# EAGLE design ctrl_out (EAGLE 8.5.0)
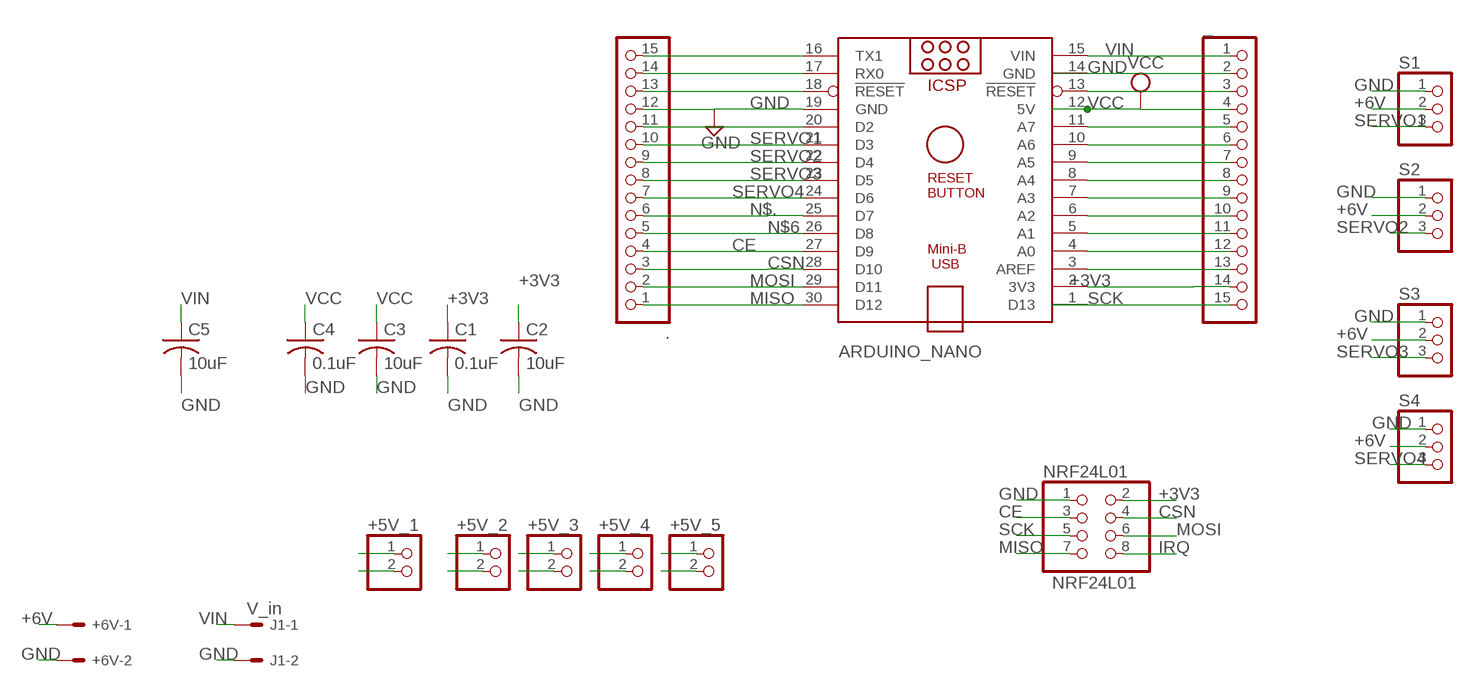
[diagram p0: schematic, sheet 1]

## Parts
+5V_1  PINHD-1X2  [1X02]
+5V_2  PINHD-1X2  [1X02]
+5V_3  PINHD-1X2  [1X02]
+5V_4  PINHD-1X2  [1X02]
+5V_5  PINHD-1X2  [1X02]
+6V  22-27-2021-02  [6410-02]
.  PINHD-1X15  [1X15]
_  PINHD-1X15  [1X15]
ARDUINO_NANO  ARDUINO_NANO  [ARDUINO_NANO]
C1  0.1uF  C-USC1206  [C1206]
C2  10uF  C-USC1206  [C1206]
C3  10uF  C-USC1206  [C1206]
C4  0.1uF  C-USC1206  [C1206]
C5  10uF  C-USC1206  [C1206]
J1  V_in  22-27-2021-02  [6410-02]
NRF24L01  PINHD-2X4  [2X04]
S1  PINHD-1X3  [1X03]
S2  PINHD-1X3  [1X03]
S3  PINHD-1X3  [1X03]
S4  PINHD-1X3  [1X03]

## Nets
+3V3: _.14 ARDUINO_NANO.2(3V3) C1.1 C2.1 NRF24L01.2
+6V: +6V.1 S1.2 S2.2 S3.2 S4.2
CE: ..4 ARDUINO_NANO.27(D9) NRF24L01.3
CSN: ..3 ARDUINO_NANO.28(D10) NRF24L01.4
GND: +5V_1.2 +5V_2.2 +5V_3.2 +5V_4.2 +5V_5.2 +6V.2 ..12 _.2 ARDUINO_NANO.14(GND) ARDUINO_NANO.19(GND) C1.2 C2.2 C3.2 C4.2 C5.2 J1.2 NRF24L01.1 S1.1 S2.1 S3.1 S4.1
IRQ: NRF24L01.8
MISO: ..1 ARDUINO_NANO.30(D12) NRF24L01.7
MOSI: ..2 ARDUINO_NANO.29(D11) NRF24L01.6
N$6: ..5 ARDUINO_NANO.26(D8)
N$12: ..11 ARDUINO_NANO.20(D2)
N$14: ..13 ARDUINO_NANO.18(!RESET)
N$15: ..14 ARDUINO_NANO.17(RX0)
N$16: ..15 ARDUINO_NANO.16(TX1)
N$19: _.3 ARDUINO_NANO.13(!RESET)
N$21: _.5 ARDUINO_NANO.11(A7)
N$22: _.6 ARDUINO_NANO.10(A6)
N$23: _.7 ARDUINO_NANO.9(A5)
N$24: _.8 ARDUINO_NANO.8(A4)
N$25: _.9 ARDUINO_NANO.7(A3)
N$26: _.10 ARDUINO_NANO.6(A2)
N$27: _.11 ARDUINO_NANO.5(A1)
N$28: _.12 ARDUINO_NANO.4(A0)
N$29: _.13 ARDUINO_NANO.3(AREF)
N$.: ..6 ARDUINO_NANO.25(D7)
SCK: _.15 ARDUINO_NANO.1(D13) NRF24L01.5
SERVO1: ..10 ARDUINO_NANO.21(D3) S1.3
SERVO2: ..9 ARDUINO_NANO.22(D4) S2.3
SERVO3: ..8 ARDUINO_NANO.23(D5) S3.3
SERVO4: ..7 ARDUINO_NANO.24(D6) S4.3
VCC: +5V_1.1 +5V_2.1 +5V_3.1 +5V_4.1 +5V_5.1 _.4 ARDUINO_NANO.12(5V) C3.1 C4.1
VIN: _.1 ARDUINO_NANO.15(VIN) C5.1 J1.1

## Library data of the parts
+5V_1-+5V_5 = pinhead:PINHD-1X2: PIN HEADER
+6V J1 = con-molex:22-?-02: CONNECTOR wire to board 2.54 mm (.1 inch) pitch header; MF: MOLEX; OC_FARNELL: unknown; OC_NEWARK: unknown
. _ = pinhead:PINHD-1X15: PIN HEADER
ARDUINO_NANO = ArduinoNanoV30:ARDUINO_NANO: Arduino Nano V3.0 Overview: The Arduino Nano is a small, complete, and breadboard-friendly board based on the ATmega328 (Arduino Nano 3.x) or ATmega168 (Arduino Nano 2.x). It has more or less the same functionality of the Arduino Duemilanove, but in a different package. It lacks only a DC power jack, and works with a Mini-B USB cable instead of a standard one. The Nano was designed and is being produced by Gravitech. Specifications: Microcontroller Atmel ATmega168 or ATmega328 Operating Voltage (logic level) 5 V Input Voltage (recommended) 7-12 V Input Voltage (limits) 6-20 V Digital I/O Pins 14 (of which 6 provide PWM output) Analog Input Pins 8 DC Current per I/O Pin 40 mA Flash Memory 16 KB (ATmega168) or 32 KB (ATmega328) of which 2 KB used by bootloader SRAM 1 KB (ATmega168) or 2 KB (ATmega328) EEPROM 512 bytes (ATmega168) or 1 KB (ATmega328) Clock Speed 16 MHz Dimensions 0.73" x 1.70" Length 45 mm Width 18 mm Weigth 5 g Power: The Arduino Nano can be powered via the Mini-B USB connection, 6-20V unregulated external power supply (pin 30), or 5V regulated external power supply (pin 27). The power source is automatically selected to the highest voltage source. Memory: The ATmega168 has 16 KB of flash memory for storing code (of which 2 KB is used for the bootloader); the ATmega328 has 32 KB, (also with 2 KB used for the bootloader). The ATmega168 has 1 KB of SRAM and 512 bytes of EEPROM (which can be read and written with the EEPROM library); the ATmega328 has 2 KB of SRAM and 1 KB of EEPROM. Input and Output: Each of the 14 digital pins on the Nano can be used as an input or output, using pinMode(), digitalWrite(), and digitalRead() functions. They operate at 5 volts. Each pin can provide or receive a maximum of 40 mA and has an internal pull-up resistor (disconnected by default) of 20-50 kOhms. In addition, some pins have specialized functions. Visit Arduino - ArduinoBoardNano <https://www.arduino.cc/en/Main/ArduinoBoardNano>
C1-C5 = rcl:C-US: CAPACITOR, American symbol; SPICEPREFIX: C
NRF24L01 = pinhead:PINHD-2X4: PIN HEADER
S1-S4 = pinhead:PINHD-1X3: PIN HEADER

## Board
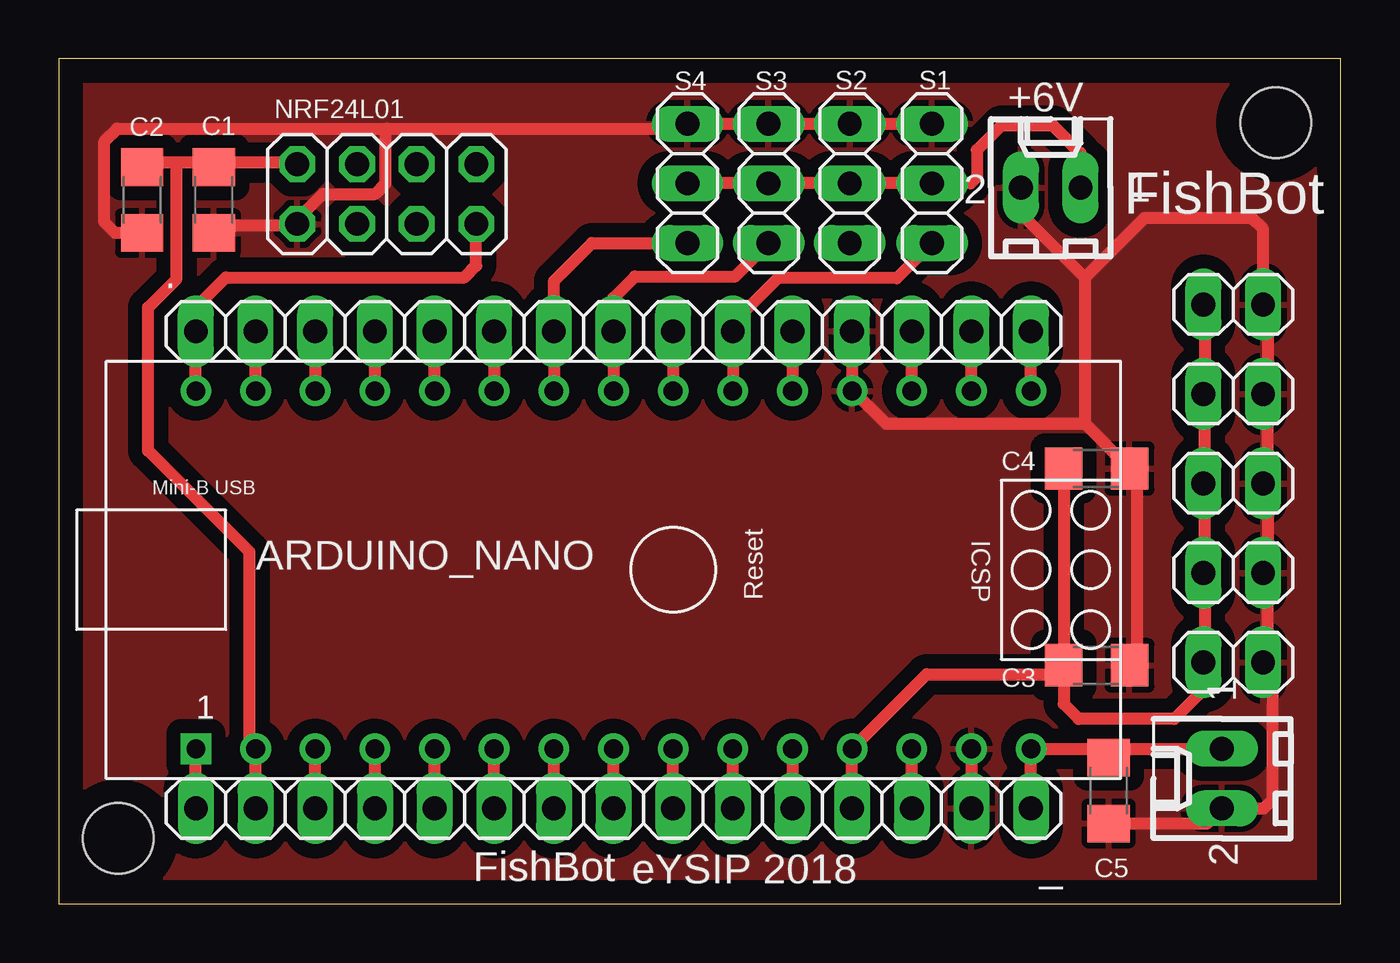
[diagram p1: board, top side]
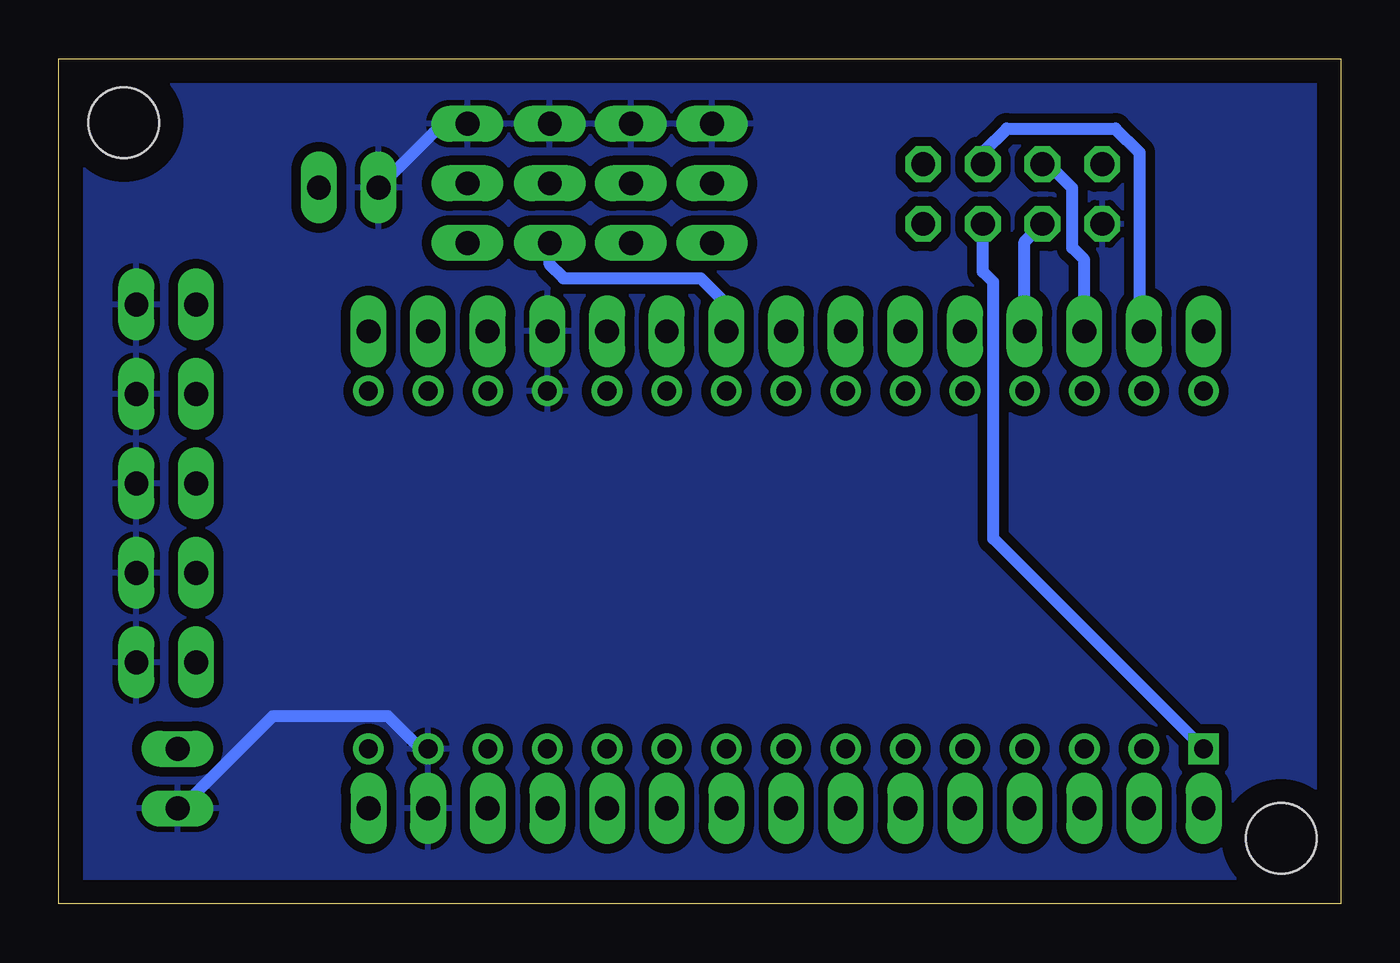
[diagram p2: board, bottom side, seen from below]

Size 54.59 x 35.99 mm. Coordinates in mm from the lower left corner, seen from the top.
Outline: 0,0 54.59,0 54.59,35.99 0,35.99 0,0
Copper layers (1*16): Top 0.035mm / dielectric 1.5mm / Bottom 0.035mm
Design rules "default *": minimum track width 6mil, minimum drill 0.35mm, track to track 15mil, track to pad 6mil, pad to pad 6mil, via to via 6mil, smd to smd 6mil, copper to edge 40mil, drill to drill 6mil, minimum pad ring 10mil, minimum via ring 8mil, stop-mask expansion 4mil, vias tented up to drill 0mil, thermal gap 10mil
Holes 3 mm at 2.54,2.79 51.82,33.27

### Footprints (pad centres in the part's own frame; a part is rotated, then mirrored left to right if it is on the bottom)
1X02 = drill 1.016 long: 1 -1.27,0; 2 1.27,0
6410-02 = drill 1.016 long: 1 1.27,0; 2 -1.27,0
1X15 = drill 1.016 long: 1 -17.78,0; 2 -15.24,0; 3 -12.7,0; 4 -10.16,0; 5 -7.62,0; 6 -5.08,0; 7 -2.54,0; 8 0,0; 9 2.54,0; 10 5.08,0; 11 7.62,0; 12 10.16,0; 13 12.7,0; 14 15.24,0; 15 17.78,0
ARDUINO_NANO = drill 0.8 square: 1 -20.32,-7.62 | drill 0.8: 2 -17.78,-7.62; 3 -15.24,-7.62; 4 -12.7,-7.62; 5 -10.16,-7.62; 6 -7.62,-7.62; 7 -5.08,-7.62; 8 -2.54,-7.62; 9 0,-7.62; 10 2.54,-7.62; 11 5.08,-7.62; 12 7.62,-7.62; 13 10.16,-7.62; 14 12.7,-7.62; 15 15.24,-7.62; 16 15.24,7.62; 17 12.7,7.62; 18 10.16,7.62; 19 7.62,7.62; 20 5.08,7.62; 21 2.54,7.62; 22 0,7.62; 23 -2.54,7.62; 24 -5.08,7.62; 25 -7.62,7.62; 26 -10.16,7.62; 27 -12.7,7.62; 28 -15.24,7.62; 29 -17.78,7.62; 30 -20.32,7.62
C1206 = smd 1.6 x 1.8: 1 -1.4,0; 2 1.4,0
2X04 = drill 1.016 octagon: 1 -3.81,-1.27; 2 -3.81,1.27; 3 -1.27,-1.27; 4 -1.27,1.27; 5 1.27,-1.27; 6 1.27,1.27; 7 3.81,-1.27; 8 3.81,1.27
1X03 = drill 1.016 long: 1 -2.54,0; 2 0,0; 3 2.54,0

### Placement (x,y rotation side)
+5V_1  50.01,10.29 0 top
+5V_2  50.01,14.1 0 top
+5V_3  50.01,17.91 0 top
+5V_4  50.01,21.72 0 top
+5V_5  50.01,25.53 0 top
+6V  42.24,30.51 0 top
.  23.62,24.38 0 top
_  23.62,4.06 180 top
ARDUINO_NANO  26.16,14.22 0 top
C1  6.6,29.97 270 top
C2  3.56,29.97 270 top
C3  44.2,10.16 0 top
C4  44.2,18.54 0 top
C5  44.7,4.83 270 top
J1  49.53,5.33 90 top
NRF24L01  13.97,30.23 0 top
S1  37.19,30.68 270 top
S2  33.68,30.68 270 top
S3  30.23,30.68 270 top
S4  26.77,30.68 270 top

### Tracks (layer width: path | path; a pad name or v marks a point on that pad's centre or on a via)
+3V3
  Top 0.508: 5.02,31.56 6.35,31.56 C1.1 6.79,31.56 9.91,31.56 NRF24L01.2 | 5.02,31.56 3.68,31.56 C2.1 | _.14 ARDUINO_NANO.2 8.13,6.67 8.13,14.99 3.81,19.3 3.81,25.4 5.02,26.61 5.02,31.56
+6V
  Top 0.508: +6V.1 43.51,31.98 42.34,33.15 40.13,33.15 39.09,32.11 39.09,30.94 38.84,30.68 S1.2 S2.2 S3.2 S4.2
CE
  Top 0.508: ARDUINO_NANO.27 ..4
  Bottom 0.508: ..4 13.46,28.19 NRF24L01.3
CSN
  Top 0.508: ..3 ARDUINO_NANO.28
  Bottom 0.508: ..3 10.92,27.43 11.43,27.94 11.43,30.48 12.45,31.5 NRF24L01.4
GND
  Top 0.508: C1.2 6.79,28.89 9.91,28.89 NRF24L01.1 10.35,29.34 11.24,30.23 13.46,30.23 13.91,30.67 13.91,32.96 13.97,33.02 | C3.2 45.91,10.22 45.91,18.22 C4.2 45.47,18.67 43.69,20.45 | 43.69,20.45 35.24,20.45 33.91,21.78 ARDUINO_NANO.19 ..12 | ARDUINO_NANO.14 _.2 | 13.97,33.02 2.49,33.02 1.94,32.47 1.94,29.03 2.4,28.57 C2.2 | 43.69,26.67 46.23,29.21 50.8,29.21 51.28,28.73 +5V_5.2 51.47,25.53 51.47,21.97 +5V_4.2 51.47,21.53 51.47,17.97 +5V_3.2 51.47,17.53 51.47,14.41 +5V_2.2 51.47,13.97 51.47,10.41 +5V_1.2 51.47,9.97 51.69,9.75 51.69,4.45 51.31,4.06 J1.2 48.89,3.43 C5.2 | 43.69,26.67 43.69,20.45 | S1.1 S2.1 S3.1 S4.1 26.57,33.02 13.97,33.02 | +6V.2 40.97,29.39 43.69,26.67
  Bottom 0.508: ARDUINO_NANO.14 39.24,6.67 40.58,8 45.47,8 49.47,4 J1.2 | ..12 33.78,25.15 | +6V.2 38.25,33.22 S1.1
  pour Top (isolate 0.61): 0.51,35.05 54.1,35.05 54.1,0.51 0.51,0.51
  pour Bottom (isolate 0.406): 0.51,35.05 54.1,35.05 54.1,0.51 0.51,0.51
MISO
  Top 0.508: ARDUINO_NANO.30 ..1 5.84,25.4 7.11,26.67 17.27,26.67 17.78,27.18 NRF24L01.7
MOSI
  Top 0.508: ARDUINO_NANO.29 ..2
  Bottom 0.508: ..2 8.57,24.45 8.57,32 9.59,33.02 14.22,33.02 15.24,32 NRF24L01.6
N$6
  Top 0.508: ARDUINO_NANO.26 ..5
N$12
  Top 0.508: ..11 ARDUINO_NANO.20
N$14
  Top 0.508: ARDUINO_NANO.18 ..13
N$15
  Top 0.508: ARDUINO_NANO.17 ..14
N$16
  Top 0.508: ARDUINO_NANO.16 ..15
N$19
  Top 0.508: _.3 ARDUINO_NANO.13
N$21
  Top 0.508: ARDUINO_NANO.11 _.5
N$22
  Top 0.508: _.6 ARDUINO_NANO.10
N$23
  Top 0.508: _.7 ARDUINO_NANO.9
N$24
  Top 0.508: _.8 ARDUINO_NANO.8
N$25
  Top 0.508: _.9 ARDUINO_NANO.7
N$26
  Top 0.508: _.10 ARDUINO_NANO.6
N$27
  Top 0.508: _.11 ARDUINO_NANO.5
N$28
  Top 0.508: _.12 ARDUINO_NANO.4
N$29
  Top 0.508: _.13 ARDUINO_NANO.3
N$.
  Top 0.508: ..6 ARDUINO_NANO.25
SCK
  Top 0.508: _.15 ARDUINO_NANO.1
  Bottom 0.508: NRF24L01.5 15.24,26.92 14.79,26.48 14.79,15.56 ARDUINO_NANO.1
SERVO1
  Top 0.508: 28.57,24.45 ..10 | ..10 ARDUINO_NANO.21 | ..10 28.91,24.59 28.91,24.92 30.63,26.64 35.69,26.64 S1.3
SERVO2
  Top 0.508: ..9 ARDUINO_NANO.22
  Bottom 0.508: S2.3 33.68,27.23 33.1,26.64 27.25,26.64 26.16,25.55 ..9
SERVO3
  Top 0.508: ARDUINO_NANO.23 ..8 23.62,25.81 24.54,26.72 28.8,26.72 S3.3
SERVO4
  Top 0.508: 21.46,24.45 ..7 | ..7 ARDUINO_NANO.24 | ..7 21.08,26.52 22.71,28.14 S4.3
VCC
  Top 0.508: +5V_5.1 48.81,25.53 48.81,21.97 +5V_4.1 48.81,21.53 48.81,17.97 +5V_3.1 48.81,17.53 48.81,14.41 +5V_2.1 48.81,13.97 48.81,10.41 +5V_1.1 48.74,9.12 47.5,7.87 43.43,7.87 42.8,8.51 C3.1 | C3.1 42.8,10.22 42.8,18.22 C4.1 | C3.1 42.35,9.78 36.96,9.78 ARDUINO_NANO.12 _.4 | 42.8,9.78 C3.1
VIN
  Top 0.508: _.1 ARDUINO_NANO.15 44.7,6.6 | 44.7,6.6 45.21,6.6 | 45.21,6.6 J1.1 | 45.21,6.48 45.21,6.6 | C5.1 44.7,6.6

### Text on the board
tNames: +6V | FishBot | FishBot | eYSIP 2018